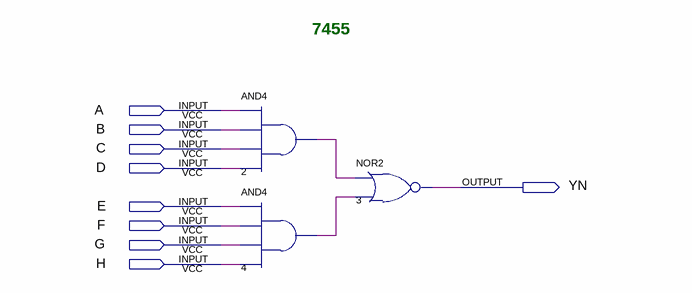
[diagram p0: schematic sheet]
// Quartus schematic a7455.bdf as structural Verilog: 3 symbols, 9 pins
module a7455 (
  input  A,
  input  B,
  input  C,
  input  D,
  input  E,
  input  F,
  input  G,
  input  H,
  output YN
);

  wire n2_out, n4_out;

  and u_2 (n2_out, A, B, C, D);
  and u_4 (n4_out, E, F, G, H);
  nor u_3 (YN, n2_out, n4_out);

  // Notes on the sheet:
  //   7455
endmodule
